# Altium schematic sheet TopLevel.SCHDOC
size A4
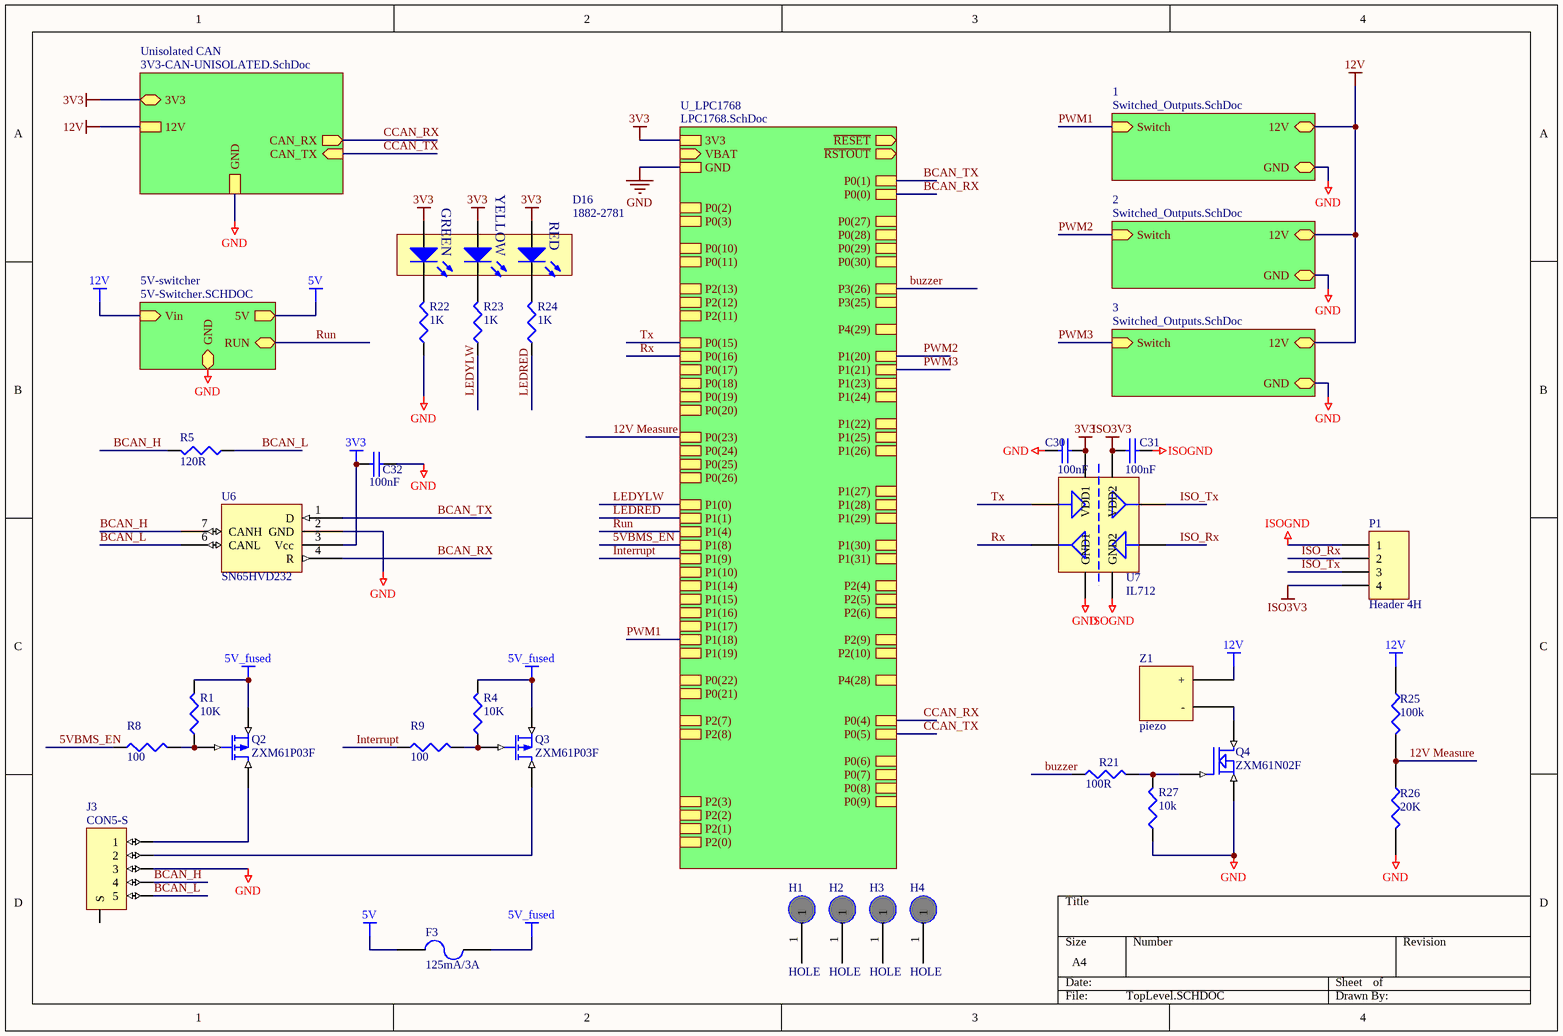
[diagram p0: TopLevel.SCHDOC]

## Parts
C30  100nF  [0603]
C31  100nF  [0603]
C32  100nF  [0603]
D16  1882-2781  [LED_TRILEVEL]
F3  125mA/3A  [LITTELFUSE-154]
H1  HOLE  [M2.5]
H2  HOLE  [M2.5]
H3  HOLE  [M2.5]
H4  HOLE  [M2.5]
J3  CON5-S  [TRIAD5F]
P1  Header 4H  [HDR1X4H]
Q2  ZXM61P03F  [SOT23-3]
Q3  ZXM61P03F  [SOT23-3]
Q4  ZXM61N02F  [SOT23-3]
R1  10K  [0603]
R4  10K  [0603]
R5  120R  [0603]
R8  100  [0603]
R9  100  [0603]
R21  100R  [0603]
R22  1K  [0603]
R23  1K  [0603]
R24  1K  [0603]
R25  100k  [1206]
R26  20K  [1206]
R27  10k  [0603]
U6  SN65HVD232  [SO8]
U7  IL712  [SO8]
Z1  piezo  [piezo]

## Sub-sheets
1 = Switched_Outputs.SchDoc: Switch (in), 12V, GND
2 = Switched_Outputs.SchDoc: Switch (in), 12V, GND
3 = Switched_Outputs.SchDoc: Switch (in), 12V, GND
5V-switcher = 5V-Switcher.SCHDOC: GND, 5V, Vin, RUN
U_LPC1768 = LPC1768.SchDoc: P0(26), P0(25), P0(24), P0(23), P1(31), P1(30), P0(28), P0(27), P3(26), P3(25), P0(29), P0(30), P1(18), P1(19), P1(20), P1(21), P1(22), P1(24), P1(23), P1(25), P1(26), P1(27), P1(28), P1(29), P0(0), P0(1), P0(10), P0(11), P2(13), P2(12), P2(11), P2(10), P0(22), P0(21), P0(20), P0(19), P0(18), P0(17), P0(15), P0(16), P2(9), P2(8), P2(7), P2(6), P2(5), P2(4), P2(3), P2(2), P2(1), P2(0), P0(2), P0(3), P1(0), P1(1), P1(4), P1(8), P1(9), P1(10), P1(14), P1(15), P1(16), P1(17), P0(4), P0(5), P0(6), P0(7), P0(8), P0(9), P4(29), P4(28), GND, 3V3, ~{RSTOUT}, ~{RESET}, VBAT (in)
Unisolated CAN = 3V3-CAN-UNISOLATED.SchDoc: 12V, GND, 3V3, CAN_RX (out), CAN_TX (in)

## Nets
3V3: C30.2 C32.2 D16.4(A) D16.5(A) D16.6(A) U6.3(Vcc) U7.1(VDD1) ; sheet Unisolated CAN/3V3, sheet U_LPC1768/3V3
5V: F3.2 ; sheet 5V-switcher/5V
5V_fused: F3.1 Q2.2(D) Q3.2(D) R1.2 R4.2
12V: R25.1 Z1.1(+) ; sheet Unisolated CAN/12V, sheet 1/12V, sheet 2/12V, sheet 3/12V, sheet 5V-switcher/Vin
GND: C30.1 C32.1 J3.3 Q4.2(S) R22.1 R26.2 R27.1 U6.2(GND) U7.4(GND1) ; sheet Unisolated CAN/GND, sheet 1/GND, sheet 2/GND, sheet U_LPC1768/GND, sheet 3/GND, sheet 5V-switcher/GND
ISO3V3: C31.1 P1.4 U7.8(VDD2)
ISOGND: C31.2 P1.1 U7.5(GND2)
5VBMS_EN: R8.1 ; sheet U_LPC1768/P1(8)
12V Measure: R25.2 R26.1 ; sheet U_LPC1768/P0(23)
BCAN_H: J3.4 R5.2 U6.7(CANH)
BCAN_L: J3.5 R5.1 U6.6(CANL)
BCAN_RX: U6.4(R) ; sheet U_LPC1768/P0(0)
BCAN_TX: U6.1(D) ; sheet U_LPC1768/P0(1)
buzzer: R21.1 ; sheet U_LPC1768/P3(26)
CCAN_RX: sheet Unisolated CAN/CAN_RX, sheet U_LPC1768/P0(4)
CCAN_TX: sheet Unisolated CAN/CAN_TX, sheet U_LPC1768/P0(5)
Interrupt: R9.1 ; sheet U_LPC1768/P1(9)
ISO_Rx: P1.2 U7.6(IN2)
ISO_Tx: P1.3 U7.7(OUT1)
LEDRED: R24.1 ; sheet U_LPC1768/P1(1)
LEDYLW: R23.1 ; sheet U_LPC1768/P1(0)
PWM1: sheet 1/Switch, sheet U_LPC1768/P1(18)
PWM2: sheet 2/Switch, sheet U_LPC1768/P1(20)
PWM3: sheet U_LPC1768/P1(21), sheet 3/Switch
Run: sheet U_LPC1768/P1(4), sheet 5V-switcher/RUN
Rx: U7.3(OUT2) ; sheet U_LPC1768/P0(16)
Tx: U7.2(IN1) ; sheet U_LPC1768/P0(15)
NetD16_1: D16.1(K) R22.2
NetD16_2: D16.2(K) R23.2
NetD16_3: D16.3(K) R24.2
NetJ3_1: J3.1 Q2.3(S)
NetJ3_2: J3.2 Q3.3(S)
NetQ2_1: Q2.1(G) R1.1 R8.2
NetQ3_1: Q3.1(G) R4.1 R9.2
NetQ4_1: Q4.1(G) R21.2 R27.2
NetQ4_3: Q4.3(D) Z1.2(-)

Not connected (* = marked no-connect by the designer): H1 1; H2 1; H3 1; H4 1; J3 0(S)

## Notes on the sheet
- (in symbol LED-TRILEVEL) YELLOW; GREEN; RED

## Library data of the parts
C30-C32 = CAP: Capacitor; Farnell: 753-567; Price: 0.31
D16 = LED-TRILEVEL: Three level LED; Element14 (low stock): 1461596; Element14 Price: 4.56; Digikey: 350-1751-ND; Digikey Price: 2.84
F3 = FUSE2: Fuse; Farnell: 664-893; Other Info: www.littelfuse.com; Price: 5.67
J3 = CON5-S: Connector, 2 pin, with shield @ S; Farnell: .131-040; Price: 19.32
P1 = Header 4H: Header, 4-Pin, Right Angle; LatestRevisionDate: 17-Jul-2002; LatestRevisionNote: Re-released for DXP Platform.; Publisher: Altium Limited
Q2 Q3 = ZXM61P03F: 1.1A, 30V P-Channel Enhancement mode FET; Order#: 9525300; Price: 0.825; Supplier: Farnell
Q4 = ZXM61N02F: 1.7A, 20V N-Channel Enhancement mode FET; Farnell: 325-6194; Price: 0.75
R1 R4 R5 R8 R9 R22-R24 = RES1: Resistor; Farnell: *
R21 R25-R27 = RES1
  R21 R27: Farnell: 911-112; Price: 0.119
  R25: Farnell: 308-6422; Price: 1.010
  R26: Farnell: 308-6252; Price: 1.010
U6 = SN65HVD232: 3.3V CAN Transciever; Farnell: NA
U7 = IL712: IL712 Optical Isolator; Element14 (low stock): 9570608; Element14 Price: 9.40; Digikey: 390-1061-5-ND; Digikey Price: 5.86